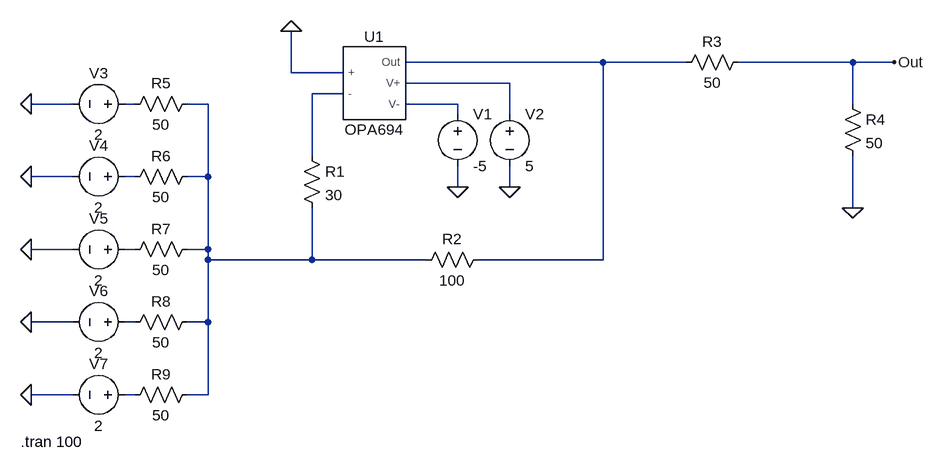
[diagram p0: schematic test_opa694_v1.asc]
test_opa694_v1.asc, the LTspice schematic file:
Version 4
SHEET 1 1020 728
WIRE 512 128 208 128
WIRE 640 128 512 128
WIRE 896 128 720 128
WIRE 960 128 896 128
WIRE 32 144 32 80
WIRE 112 144 32 144
WIRE 368 160 208 160
WIRE 112 176 64 176
WIRE -304 192 -368 192
WIRE -208 192 -224 192
WIRE -96 192 -128 192
WIRE 288 192 208 192
WIRE 896 192 896 128
WIRE 288 208 288 192
WIRE 368 208 368 160
WIRE 64 272 64 176
WIRE -304 304 -368 304
WIRE -208 304 -224 304
WIRE -96 304 -96 192
WIRE -96 304 -128 304
WIRE 288 320 288 288
WIRE 368 320 368 288
WIRE 896 352 896 272
WIRE -304 416 -368 416
WIRE -208 416 -224 416
WIRE -96 416 -96 304
WIRE -96 416 -128 416
WIRE -96 432 -96 416
WIRE 64 432 64 352
WIRE 64 432 -96 432
WIRE 240 432 64 432
WIRE 512 432 512 128
WIRE 512 432 320 432
WIRE -304 528 -368 528
WIRE -208 528 -224 528
WIRE -96 528 -96 432
WIRE -96 528 -128 528
WIRE -304 640 -368 640
WIRE -208 640 -224 640
WIRE -96 640 -96 528
WIRE -96 640 -128 640
FLAG 32 80 0
FLAG 368 320 0
FLAG 288 320 0
FLAG -368 640 0
FLAG -368 528 0
FLAG -368 416 0
FLAG -368 304 0
FLAG -368 192 0
FLAG 896 352 0
FLAG 960 128 Out
SYMBOL AutoGenerated\\OPA694 160 160 R0
SYMATTR InstName U1
SYMBOL voltage 288 192 R0
WINDOW 123 0 0 Left 0
WINDOW 39 0 0 Left 0
SYMATTR InstName V1
SYMATTR Value -5
SYMBOL voltage 368 192 R0
WINDOW 123 0 0 Left 0
WINDOW 39 0 0 Left 0
SYMATTR InstName V2
SYMATTR Value 5
SYMBOL voltage -208 192 R90
WINDOW 0 -32 56 VBottom 2
WINDOW 3 32 56 VTop 2
WINDOW 123 0 0 Left 0
WINDOW 39 0 0 Left 0
SYMATTR InstName V3
SYMATTR Value 2
SYMBOL voltage -208 304 R90
WINDOW 0 -32 56 VBottom 2
WINDOW 3 32 56 VTop 2
WINDOW 123 0 0 Left 0
WINDOW 39 0 0 Left 0
SYMATTR InstName V4
SYMATTR Value 2
SYMBOL voltage -208 416 R90
WINDOW 0 -32 56 VBottom 2
WINDOW 3 32 56 VTop 2
WINDOW 123 0 0 Left 0
WINDOW 39 0 0 Left 0
SYMATTR InstName V5
SYMATTR Value 2
SYMBOL voltage -208 528 R90
WINDOW 0 -32 56 VBottom 2
WINDOW 3 32 56 VTop 2
WINDOW 123 0 0 Left 0
WINDOW 39 0 0 Left 0
SYMATTR InstName V6
SYMATTR Value 2
SYMBOL voltage -208 640 R90
WINDOW 0 -32 56 VBottom 2
WINDOW 3 32 56 VTop 2
WINDOW 123 0 0 Left 0
WINDOW 39 0 0 Left 0
SYMATTR InstName V7
SYMATTR Value 2
SYMBOL res 48 256 R0
SYMATTR InstName R1
SYMATTR Value 30
SYMBOL res 336 416 R90
WINDOW 0 0 56 VBottom 2
WINDOW 3 32 56 VTop 2
SYMATTR InstName R2
SYMATTR Value 100
SYMBOL res 736 112 R90
WINDOW 0 0 56 VBottom 2
WINDOW 3 32 56 VTop 2
SYMATTR InstName R3
SYMATTR Value 50
SYMBOL res 880 176 R0
SYMATTR InstName R4
SYMATTR Value 50
SYMBOL res -112 176 R90
WINDOW 0 0 56 VBottom 2
WINDOW 3 32 56 VTop 2
SYMATTR InstName R5
SYMATTR Value 50
SYMBOL res -112 288 R90
WINDOW 0 0 56 VBottom 2
WINDOW 3 32 56 VTop 2
SYMATTR InstName R6
SYMATTR Value 50
SYMBOL res -112 400 R90
WINDOW 0 0 56 VBottom 2
WINDOW 3 32 56 VTop 2
SYMATTR InstName R7
SYMATTR Value 50
SYMBOL res -112 624 R90
WINDOW 0 0 56 VBottom 2
WINDOW 3 32 56 VTop 2
SYMATTR InstName R9
SYMATTR Value 50
SYMBOL res -112 512 R90
WINDOW 0 0 56 VBottom 2
WINDOW 3 32 56 VTop 2
SYMATTR InstName R8
SYMATTR Value 50
TEXT -384 712 Left 2 !.tran 100

The netlist it stands for:
* test_opa694_v1.asc
XU1 0 N003 N001 N002 N006 OPA694  ; pins + - Out V+ V-
V1 N006 0 -5
V2 N002 0 5
V3 N004 0 2
V4 N007 0 2
V5 N008 0 2
V6 N009 0 2
V7 N010 0 2
R1 N003 N005 30
R2 N001 N005 100
R3 Out N001 50
R4 Out 0 50
R5 N005 N004 50
R6 N005 N007 50
R7 N005 N008 50
R9 N005 N010 50
R8 N005 N009 50
.tran 100
.lib C:\Users\smili\Downloads\sboc068b\opa694.lib
.backanno
.end